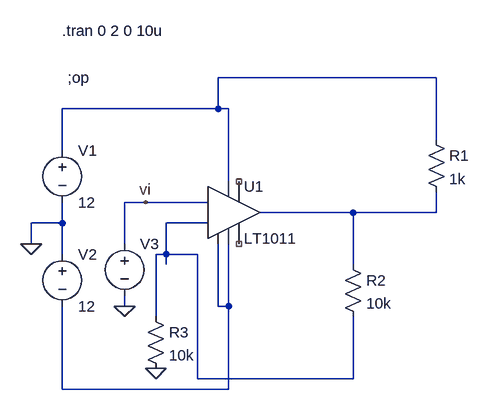
[diagram p0: schematic comparadorLt1011_1.asc]
comparadorLt1011_1.asc, the LTspice schematic file:
Version 4
SHEET 1 1044 680
WIRE 512 -48 176 -48
WIRE 176 0 176 -48
WIRE 176 0 -64 0
WIRE 192 0 176 0
WIRE 512 48 512 -48
WIRE -64 64 -64 0
WIRE 192 112 192 0
WIRE 64 144 32 144
WIRE 160 144 64 144
WIRE 384 160 240 160
WIRE 512 160 512 128
WIRE 512 160 384 160
WIRE -64 176 -64 144
WIRE -64 176 -112 176
WIRE 160 176 96 176
WIRE -112 208 -112 176
WIRE 32 208 32 144
WIRE -64 224 -64 176
WIRE 96 224 96 176
WIRE 96 224 80 224
WIRE 144 224 96 224
WIRE 96 240 96 224
WIRE 384 240 384 160
WIRE 32 304 32 288
WIRE 176 304 176 208
WIRE 192 304 192 208
WIRE 192 304 176 304
WIRE 80 320 80 224
WIRE 144 416 144 224
WIRE 384 416 384 320
WIRE 384 416 144 416
WIRE -64 432 -64 304
WIRE 192 432 192 304
WIRE 192 432 -64 432
FLAG -112 208 0
FLAG 32 304 0
FLAG 80 400 0
FLAG 64 144 vi
DATAFLAG 464 160 ""
SYMBOL Comparators\\LT1011 192 160 R0
SYMATTR InstName U1
SYMBOL voltage -64 48 R0
WINDOW 123 0 0 Left 0
WINDOW 39 0 0 Left 0
SYMATTR InstName V1
SYMATTR Value 12
SYMBOL voltage -64 208 R0
WINDOW 123 0 0 Left 0
WINDOW 39 0 0 Left 0
SYMATTR InstName V2
SYMATTR Value 12
SYMBOL res 496 32 R0
SYMATTR InstName R1
SYMATTR Value 1k
SYMBOL voltage 32 192 R0
WINDOW 3 24 96 Invisible 2
WINDOW 123 0 0 Left 0
WINDOW 39 0 0 Left 0
SYMATTR Value PWL(0 -12 1 12 2 -12 3 -12)
SYMATTR InstName V3
SYMBOL res 368 224 R0
SYMATTR InstName R2
SYMATTR Value 10k
SYMBOL res 64 304 R0
SYMATTR InstName R3
SYMATTR Value 10k
TEXT -56 -48 Left 2 !;op
TEXT -64 -120 Left 2 !.tran 0 2 0 10u

The netlist it stands for:
* comparadorLt1011_1.asc
XU1 N004 N003 vi N004 NC_01 NC_02 N002 N001 LT1011
V1 N001 0 12
V2 0 N004 12
R1 N001 N002 1k
V3 vi 0 PWL(0 -12 1 12 2 -12 3 -12)
R2 N002 N003 10k
R3 N003 0 10k
;op
.tran 0 2 0 10u
.lib LTC1.lib
.backanno
.end